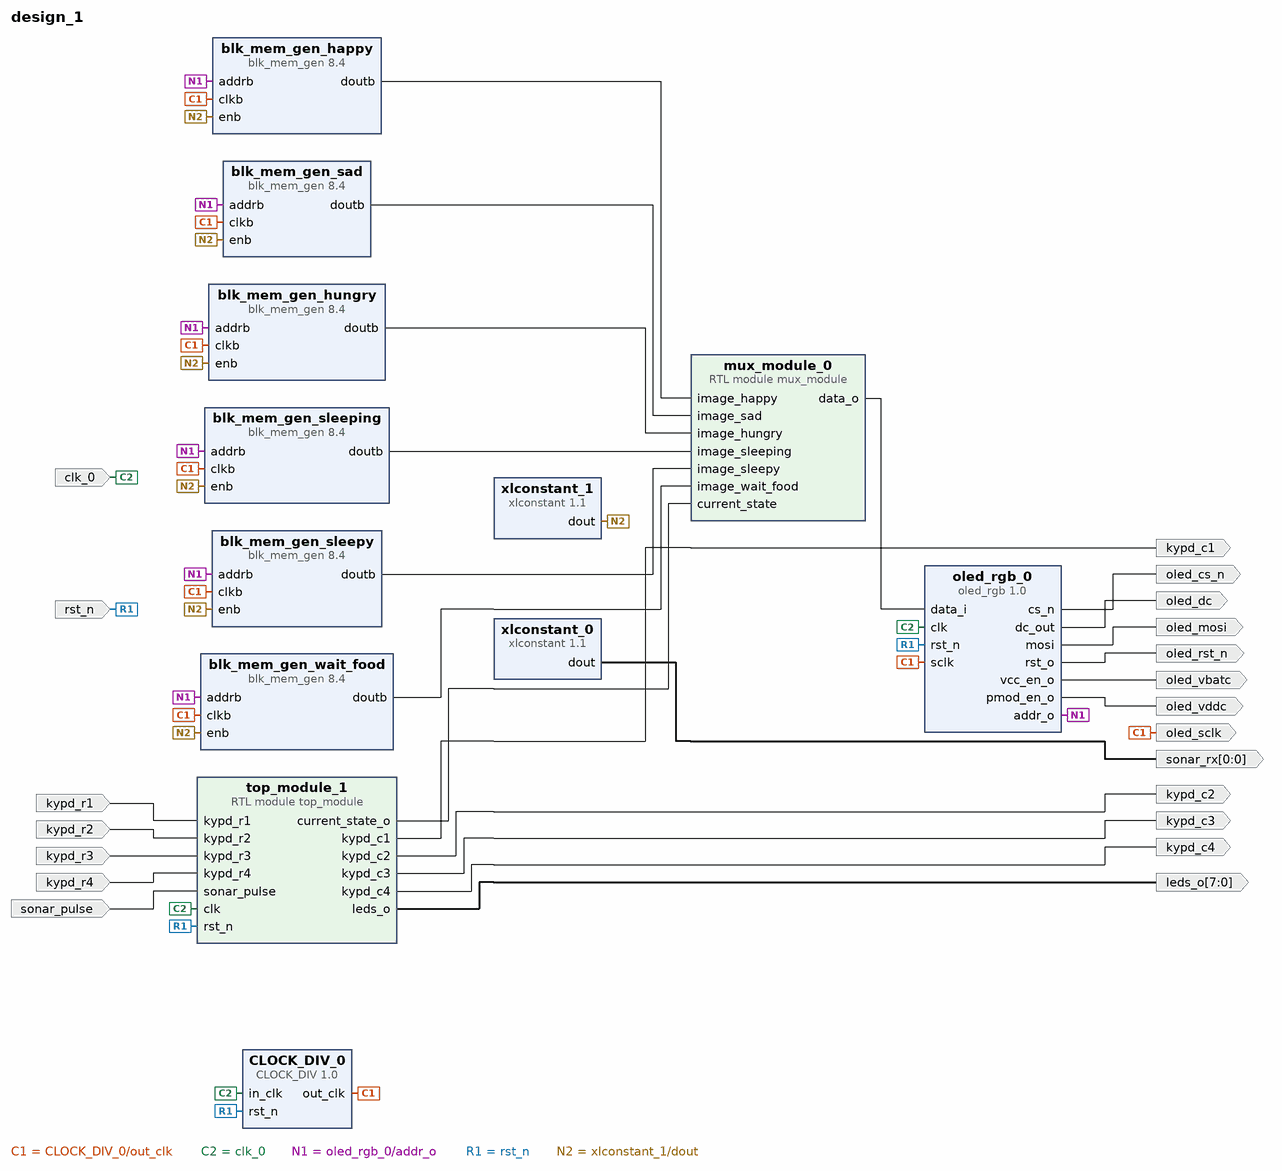
[diagram p0: block diagram of the top level]
# Vivado block design design_1, xc7z020clg484-1, Vivado 2024.2
create_bd_design design_1

create_bd_port -dir I -type clk clk_0
create_bd_port -dir I -type rst rst_n
create_bd_port -dir I sonar_pulse
create_bd_port -dir O oled_cs_n
create_bd_port -dir O oled_mosi
create_bd_port -dir O oled_dc
create_bd_port -dir O -type rst oled_rst_n
create_bd_port -dir O oled_vbatc
create_bd_port -dir O oled_vddc
create_bd_port -dir O -from 7 -to 0 leds_o
create_bd_port -dir I kypd_r4
create_bd_port -dir I kypd_r3
create_bd_port -dir I kypd_r2
create_bd_port -dir I kypd_r1
create_bd_port -dir O kypd_c4
create_bd_port -dir O kypd_c3
create_bd_port -dir O kypd_c2
create_bd_port -dir O kypd_c1
create_bd_port -dir O -from 0 -to 0 sonar_rx
create_bd_port -dir O -type clk oled_sclk

create_bd_cell -type module -reference top_module top_module_1
create_bd_cell -type ip -vlnv user.org:user:CLOCK_DIV:1.0 CLOCK_DIV_0
set_property -dict {CONFIG.IN_CLK_F 100000000 CONFIG.OUT_CLK_F 5000000} [get_bd_cells CLOCK_DIV_0]
create_bd_cell -type ip -vlnv xilinx.com:ip:blk_mem_gen:8.4 blk_mem_gen_happy
set_property -dict [list \
  CONFIG.Coe_File ../../../../new/happy.coe \
  CONFIG.Fill_Remaining_Memory_Locations true \
  CONFIG.Load_Init_File true \
  CONFIG.Memory_Type Simple_Dual_Port_RAM \
  CONFIG.Register_PortB_Output_of_Memory_Primitives true \
  CONFIG.Write_Depth_A 6144 \
  CONFIG.Write_Width_A 16 \
  CONFIG.use_bram_block Stand_Alone \
] [get_bd_cells blk_mem_gen_happy]
create_bd_cell -type ip -vlnv xilinx.com:ip:xlconstant:1.1 xlconstant_0
set_property -dict {CONFIG.CONST_VAL 1} [get_bd_cells xlconstant_0]
create_bd_cell -type ip -vlnv xilinx.com:ip:xlconstant:1.1 xlconstant_1
create_bd_cell -type ip -vlnv xilinx.com:ip:blk_mem_gen:8.4 blk_mem_gen_sad
set_property -dict [list \
  CONFIG.Coe_File ../../../../new/sad.coe \
  CONFIG.Fill_Remaining_Memory_Locations true \
  CONFIG.Load_Init_File true \
  CONFIG.Memory_Type Simple_Dual_Port_RAM \
  CONFIG.Write_Depth_A 6144 \
  CONFIG.Write_Width_A 16 \
  CONFIG.use_bram_block Stand_Alone \
] [get_bd_cells blk_mem_gen_sad]
create_bd_cell -type module -reference mux_module mux_module_0
create_bd_cell -type ip -vlnv xilinx.com:ip:blk_mem_gen:8.4 blk_mem_gen_hungry
set_property -dict [list \
  CONFIG.Coe_File ../../../../new/hungry.coe \
  CONFIG.Fill_Remaining_Memory_Locations true \
  CONFIG.Load_Init_File true \
  CONFIG.Memory_Type Simple_Dual_Port_RAM \
  CONFIG.Register_PortB_Output_of_Memory_Primitives false \
  CONFIG.Write_Depth_A 6144 \
  CONFIG.Write_Width_A 16 \
  CONFIG.use_bram_block Stand_Alone \
] [get_bd_cells blk_mem_gen_hungry]
create_bd_cell -type ip -vlnv xilinx.com:ip:blk_mem_gen:8.4 blk_mem_gen_sleepy
set_property -dict [list \
  CONFIG.Coe_File ../../../../new/sleepy.coe \
  CONFIG.Fill_Remaining_Memory_Locations true \
  CONFIG.Load_Init_File true \
  CONFIG.Memory_Type Simple_Dual_Port_RAM \
  CONFIG.Write_Depth_A 6144 \
  CONFIG.Write_Width_A 16 \
  CONFIG.use_bram_block Stand_Alone \
] [get_bd_cells blk_mem_gen_sleepy]
create_bd_cell -type ip -vlnv xilinx.com:ip:blk_mem_gen:8.4 blk_mem_gen_sleeping
set_property -dict [list \
  CONFIG.Coe_File ../../../../new/sleeping.coe \
  CONFIG.Fill_Remaining_Memory_Locations true \
  CONFIG.Load_Init_File true \
  CONFIG.Memory_Type Simple_Dual_Port_RAM \
  CONFIG.Write_Depth_A 6144 \
  CONFIG.Write_Width_A 16 \
  CONFIG.use_bram_block Stand_Alone \
] [get_bd_cells blk_mem_gen_sleeping]
create_bd_cell -type ip -vlnv xilinx.com:ip:blk_mem_gen:8.4 blk_mem_gen_wait_food
set_property -dict [list \
  CONFIG.Coe_File ../../../../new/waiting_for_food.coe \
  CONFIG.Fill_Remaining_Memory_Locations true \
  CONFIG.Load_Init_File true \
  CONFIG.Memory_Type Simple_Dual_Port_RAM \
  CONFIG.Write_Depth_A 6144 \
  CONFIG.Write_Width_A 16 \
  CONFIG.use_bram_block Stand_Alone \
] [get_bd_cells blk_mem_gen_wait_food]
create_bd_cell -type ip -vlnv eis:user:oled_rgb:1.0 oled_rgb_0

# ---- connections ----

connect_bd_net [get_bd_pins CLOCK_DIV_0/out_clk] \
  [get_bd_ports oled_sclk] [get_bd_pins blk_mem_gen_happy/clkb] [get_bd_pins blk_mem_gen_sad/clkb] \
  [get_bd_pins blk_mem_gen_wait_food/clkb] [get_bd_pins blk_mem_gen_hungry/clkb] [get_bd_pins blk_mem_gen_sleepy/clkb] \
  [get_bd_pins blk_mem_gen_sleeping/clkb] [get_bd_pins oled_rgb_0/sclk]
connect_bd_net -net blk_mem_gen_0_doutb [get_bd_pins blk_mem_gen_happy/doutb] [get_bd_pins mux_module_0/image_happy]
connect_bd_net -net blk_mem_gen_1_doutb [get_bd_pins blk_mem_gen_sad/doutb] [get_bd_pins mux_module_0/image_sad]
connect_bd_net [get_bd_pins blk_mem_gen_hungry/doutb] [get_bd_pins mux_module_0/image_hungry]
connect_bd_net [get_bd_pins blk_mem_gen_sleeping/doutb] [get_bd_pins mux_module_0/image_sleeping]
connect_bd_net [get_bd_pins blk_mem_gen_sleepy/doutb] [get_bd_pins mux_module_0/image_sleepy]
connect_bd_net [get_bd_pins blk_mem_gen_wait_food/doutb] [get_bd_pins mux_module_0/image_wait_food]
connect_bd_net -net clk_0_1 [get_bd_ports clk_0] [get_bd_pins CLOCK_DIV_0/in_clk] [get_bd_pins top_module_1/clk] [get_bd_pins oled_rgb_0/clk]
connect_bd_net -net kypd_r1_1 [get_bd_ports kypd_r1] [get_bd_pins top_module_1/kypd_r1]
connect_bd_net -net kypd_r2_1 [get_bd_ports kypd_r2] [get_bd_pins top_module_1/kypd_r2]
connect_bd_net -net kypd_r3_1 [get_bd_ports kypd_r3] [get_bd_pins top_module_1/kypd_r3]
connect_bd_net -net kypd_r4_1 [get_bd_ports kypd_r4] [get_bd_pins top_module_1/kypd_r4]
connect_bd_net [get_bd_pins mux_module_0/data_o] [get_bd_pins oled_rgb_0/data_i]
connect_bd_net [get_bd_pins oled_rgb_0/cs_n] [get_bd_ports oled_cs_n]
connect_bd_net [get_bd_pins oled_rgb_0/dc_out] [get_bd_ports oled_dc]
connect_bd_net [get_bd_pins oled_rgb_0/mosi] [get_bd_ports oled_mosi]
connect_bd_net [get_bd_pins oled_rgb_0/pmod_en_o] [get_bd_ports oled_vddc]
connect_bd_net [get_bd_pins oled_rgb_0/rst_o] [get_bd_ports oled_rst_n]
connect_bd_net [get_bd_pins oled_rgb_0/vcc_en_o] [get_bd_ports oled_vbatc]
connect_bd_net -net rgb_oled_0_addr_o_0 [get_bd_pins oled_rgb_0/addr_o] \
  [get_bd_pins blk_mem_gen_happy/addrb] [get_bd_pins blk_mem_gen_sad/addrb] [get_bd_pins blk_mem_gen_sleeping/addrb] \
  [get_bd_pins blk_mem_gen_wait_food/addrb] [get_bd_pins blk_mem_gen_hungry/addrb] [get_bd_pins blk_mem_gen_sleepy/addrb]
connect_bd_net [get_bd_ports rst_n] [get_bd_pins CLOCK_DIV_0/rst_n] [get_bd_pins top_module_1/rst_n] [get_bd_pins oled_rgb_0/rst_n]
connect_bd_net [get_bd_ports sonar_pulse] [get_bd_pins top_module_1/sonar_pulse]
connect_bd_net [get_bd_pins top_module_1/current_state_o] [get_bd_pins mux_module_0/current_state]
connect_bd_net [get_bd_pins top_module_1/kypd_c1] [get_bd_ports kypd_c1]
connect_bd_net [get_bd_pins top_module_1/kypd_c2] [get_bd_ports kypd_c2]
connect_bd_net [get_bd_pins top_module_1/kypd_c3] [get_bd_ports kypd_c3]
connect_bd_net [get_bd_pins top_module_1/kypd_c4] [get_bd_ports kypd_c4]
connect_bd_net [get_bd_pins top_module_1/leds_o] [get_bd_ports leds_o]
connect_bd_net [get_bd_pins xlconstant_0/dout] [get_bd_ports sonar_rx]
connect_bd_net [get_bd_pins xlconstant_1/dout] \
  [get_bd_pins blk_mem_gen_happy/enb] [get_bd_pins blk_mem_gen_sad/enb] [get_bd_pins blk_mem_gen_hungry/enb] \
  [get_bd_pins blk_mem_gen_sleeping/enb] [get_bd_pins blk_mem_gen_wait_food/enb] [get_bd_pins blk_mem_gen_sleepy/enb]

validate_bd_design
save_bd_design
